# Altium schematic sheet voltageconverter.SchDoc
size 297 x 209 mm
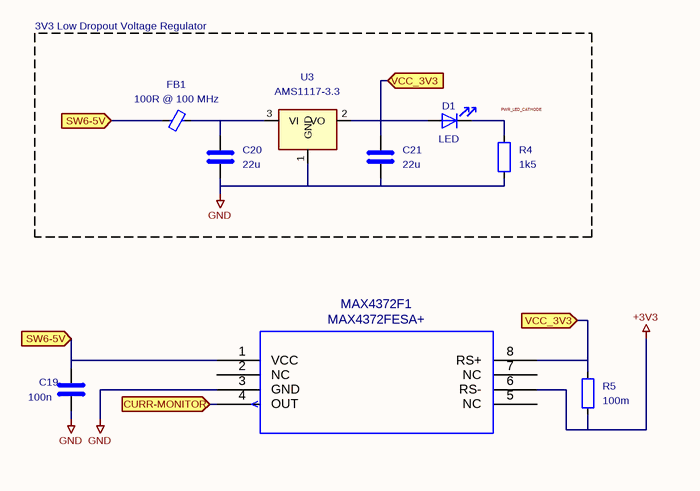
[diagram p0: voltageconverter.SchDoc]

## Parts
C19  100n  [C_0603_1608Metric]
C20  22u  [C_0603_1608Metric]
C21  22u  [C_0603_1608Metric]
D1  LED  [LED_0603_1608Metric]
FB1  100R @ 100 MHz  [L_0603_1608Metric]
MAX4372F1  MAX4372FESA+  [SOIC127P600X175-8N]
R4  1k5  [R_0603_1608Metric]
R5  100m  [R_0402_1005Metric]
U3  AMS1117-3.3  [SOT-223-3_TabPin2]

## Ports
CURR-MONITOR (in), SW6-5V (in), VCC_3V3 (in)

## Nets
+3V3: MAX4372F1.6(RS-) R5.2
GND: C19.2 C20.2 C21.2 MAX4372F1.3(GND) R4.1 U3.1(GND)
CURR-MONITOR: MAX4372F1.4(OUT) ; port CURR-MONITOR
SW6-5V: C19.1 FB1.2 MAX4372F1.1(VCC) ; port SW6-5V
VCC_3V3: C21.1 D1.2(A) MAX4372F1.8(RS+) R5.1 U3.2(VO) ; port VCC_3V3
NetC20_1: C20.1 FB1.1 U3.3(VI)
NetD1_1: D1.1(K) R4.2

Not connected (* = marked no-connect by the designer): MAX4372F1 2(NC) 5(NC) 7(NC)

## Notes on the sheet
- 3V3 Low Dropout Voltage Regulator
- Labels drawn without touching a wire or pin: PWR_LED_CATHODE
- 1
- 2
- 3
- 4
- 5
- 6
- A
- B
- C
- D
- Title:
- File: voltageconverter.kicad_sch
- Sheet: /
- KiCad E.D.A.  kicad (5.1.4)-1
- Size: A4
- Date:
- Rev:
- Id: 1/1

## Library data of the parts
C19-C21 = C: Footprint: Capacitor_SMD:C_0603_1608Metric
  C19: Value: 100n
  C20 C21: Value: 22u
FB1 = FerriteBead_Small: Value: 100R @ 100 MHz; Footprint: Inductor_SMD:L_0603_1608Metric
MAX4372F1 = MAX4372FESA+-MAX4372FESA+: Value: MAX4372FESA+; Footprint: STM32_Breakout:SOIC127P600X175-8N
R4 R5 = R
  R4: Value: 1k5; Footprint: Resistor_SMD:R_0603_1608Metric
  R5: Value: 100m; Footprint: Resistor_SMD:R_0402_1005Metric
D1 = LED: Value: LED; Footprint: LED_SMD:LED_0603_1608Metric
U3 = AMS1117-3.3: Value: AMS1117-3.3; Footprint: Package_TO_SOT_SMD:SOT-223-3_TabPin2